# Altium schematic sheet LSM6DSMTR.SchDoc
size A
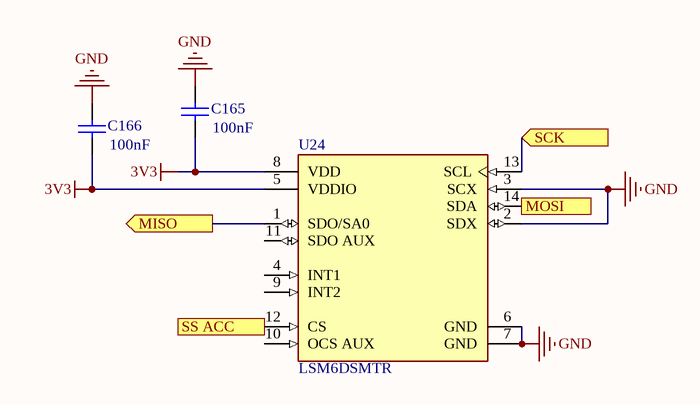
[diagram p0: LSM6DSMTR.SchDoc]

## Parts
C165  value 100nF  [1608[0603]]  (hidden comment: Cap)
C166  value 100nF  [1608[0603]]  (hidden comment: Cap)
U24  LSM6DSMTR  [FP-LGA-14L-DM00249496-MFG]

## Ports
MISO (out), MOSI (in), SCK (in), SS ACC (in)

## Nets
3V3: C165.2 C166.2 U24.5(VDDIO) U24.8(VDD)
GND: C165.1 C166.1 U24.2(SDX) U24.3(SCX) U24.6(GND) U24.7(GND)
MISO: U24.1(SDO/SA0) ; port MISO
MOSI: U24.14(SDA) ; port MOSI
SCK: U24.13(SCL) ; port SCK
SS ACC: U24.12(CS) ; port SS ACC

Not connected (* = marked no-connect by the designer): U24 4(INT1) 9(INT2) 10(OCS_AUX) 11(SDO_AUX)

## Library data of the parts
C165 C166 = Cap: Capacitor; Published: 8-Jun-2000; LatestRevisionDate: 17-Jul-2002; LatestRevisionNote: Re-released for DXP Platform.; PackageReference: RAD-0.3; Publisher: Altium Limited; PackageDescription: Radial Cap, Thru-Hole; 2 Leads; 0.3 in Pin Spacing
U24 = CMP-12177-000008-1: IMU ACCEL/GYRO I2C/SPI 14LGA; Manufacturer: STMicroelectronics; Operating Supply Current: 0.29-0.65mA; Gyro Range: 125/250/500/1000/2000°/s; Sensor Output: I2C,SPI; Accel Range: 2/4/8/16g; Min Supply Voltage: 1.62V; Resolution: 16bits; Sensor Type: Temperature,Accelerometer,Gyroscope; Max Supply Voltage: 3.6V; Manufacturer Part Number: LSM6DSMTR; Octopart: https://octopart.com/lsm6dsmtr-stmicroelectronics-66358194; Height: 0.86mm; Category: IC; Lead Free: Yes; Temperature: -40°C to +85°C; Temperature Range Low: -40°C; ComponentLink2Description: Datasheet; ComponentLink2URL: https://www.st.com/resource/en/datasheet/lsm6dsm.pdf; Digikey Description: IMU ACCEL/GYRO I2C/SPI 14LGA; Footprint Url: https://www.st.com/content/ccc/resource/technical/document/technical_note/73/17/9c/16/dd/96/4a/01/CD00134799.pdf/files/CD00134799.pdf/jcr:content/translations/en.CD00134799.pdf; Device Class L1: Sensors; Device Class L2: Motion Sensors; Temperature Range High: +85°C; Mouser Description: LSM6DSM Series 3.6 V I2C/SPI 3D Accelerometer and 3D Gyroscope - LGA-14; Device Class L3: Inertial Measurement Units (IMUs); Automotive: No; Package: LGA-14L-DM00249496; RoHS: TRUE